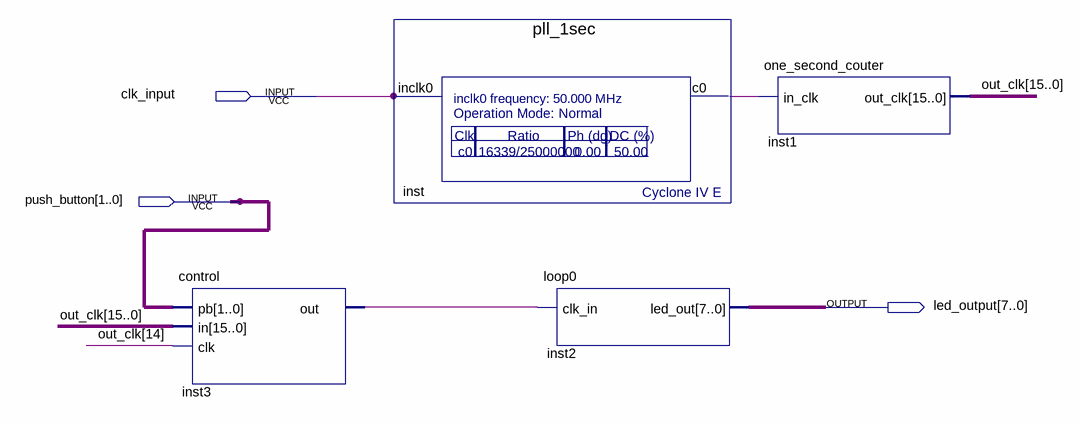
[diagram p0: schematic sheet]
// Quartus schematic runaway_scm.bdf as structural Verilog: 4 symbols, 3 pins
module runaway_scm (
  input  clk_input,
  input  [1:0] push_button,
  output [7:0] led_output
);

  wire inst3_out, inst_c0;
  wire [15:0] out_clk;

  control inst3 (.pb(push_button), .in(out_clk), .clk(out_clk[14]), .out(inst3_out));
  pll_1sec inst (.inclk0(clk_input), .c0(inst_c0));
  loop0 inst2 (.clk_in(inst3_out), .led_out(led_output));
  one_second_couter inst1 (.in_clk(inst_c0), .out_clk(out_clk));
endmodule
